# EAGLE design super-nintendo-forever (EAGLE 7.7.0)
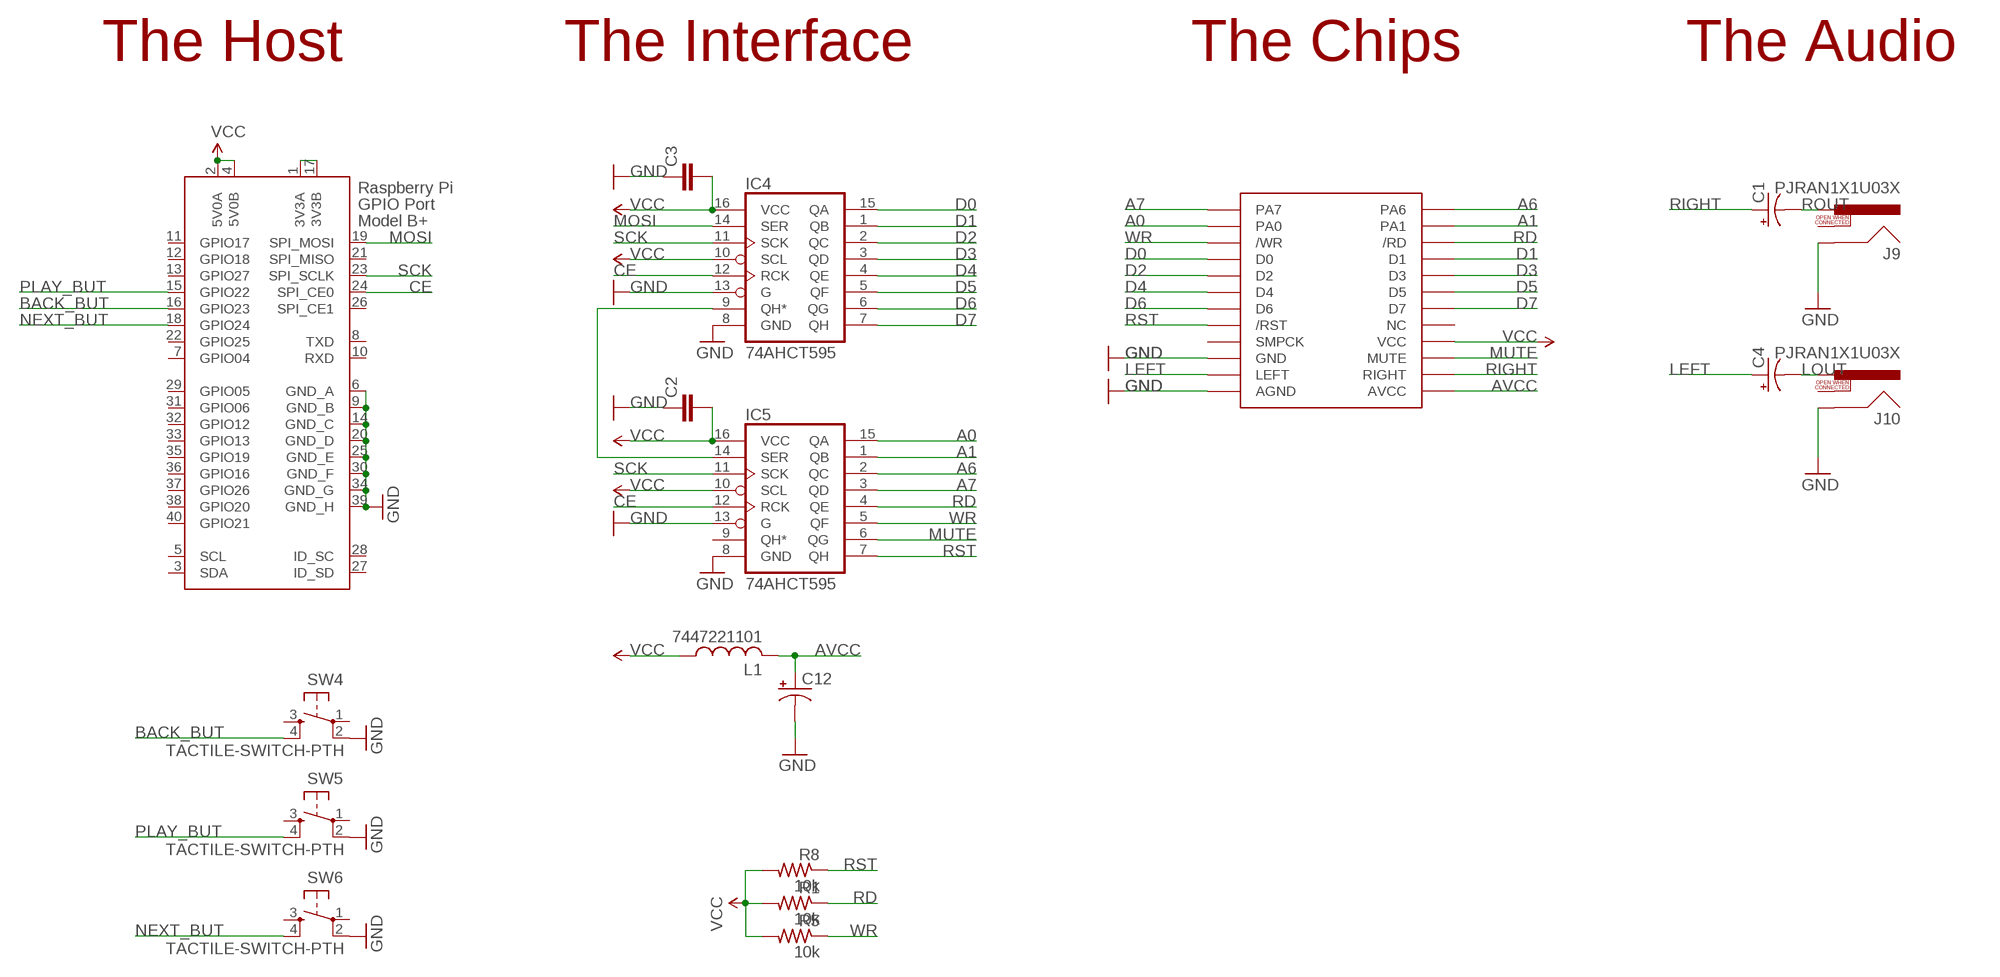
[diagram p0: schematic, sheet 1]

## Parts
C1  CPOL-USE2-4  [E2-4]
C2  C-EU025-024X044  [C025-024X044]
C3  C-EU025-024X044  [C025-024X044]
C4  CPOL-USE2-4  [E2-4]
C12  CPOL-USE2-4  [E2-4]
IC4  74AHCT595  74LS595N  [DIL16]
IC5  74AHCT595  74LS595N  [DIL16]
J9  PJRAN1X1U03X  RCA  [RCA]
J10  PJRAN1X1U03X  RCA  [RCA]
L1  7447221101  L  [12MMINDUCTOR]
R1  10k  R-US_0207/7  [0207/7]
R5  10k  R-US_0207/7  [0207/7]
R8  10k  R-US_0207/7  [0207/7]
SW4  TACTILE-SWITCH-PTH  [TAC-SWITCH-PTH]
SW5  TACTILE-SWITCH-PTH  [TAC-SWITCH-PTH]
SW6  TACTILE-SWITCH-PTH  [TAC-SWITCH-PTH]
U$1  APU2  [APU3]
X2  RASPI_BOARD_B+#_E4  [RASPI_BOARD_B+_EDGES_4DRILL]

## Nets
3.3V [Power]: X2.1(3V3A) X2.17(3V3B)
A0: IC5.15(QA) U$1.A0
A1: IC5.1(QB) U$1.PA1
A6: IC5.2(QC) U$1.PA6
A7: IC5.3(QD) U$1.A7
AVCC [Power]: C12.+ L1.3 U$1.VCCA(AVCC)
BACK_BUT: SW4.4 X2.16(GPIO23)
CE: IC4.12(RCK) IC5.12(RCK) X2.24(SPI_CE0)
D0: IC4.15(QA) U$1.D0
D1: IC4.1(QB) U$1.D1
D2: IC4.2(QC) U$1.D2
D3: IC4.3(QD) U$1.D3
D4: IC4.4(QE) U$1.D4
D5: IC4.5(QF) U$1.D5
D6: IC4.6(QG) U$1.D6
D7: IC4.7(QH) U$1.D7
GND [Power]: C2.1 C3.1 C12.- IC4.8(GND) IC4.13(G) IC5.8(GND) IC5.13(G) J9.SHELL J10.SHELL SW4.2 SW5.2 SW6.2 U$1.GND U$1.GNDA(AGND) U$1.P$25(GND) U$1.P$26(GND) X2.6(GND_A) X2.9(GND_B) X2.14(GND_C) X2.20(GND_D) X2.25(GND_E) X2.30(GND_F) X2.34(GND_G) X2.39(GND_H)
LEFT: C4.+ U$1.OUTL(LEFT)
LOUT: C4.- J10.PIN
MOSI: IC4.14(SER) X2.19(SPI_MOSI)
MUTE: IC5.6(QG) U$1.MUTE
N$16: IC4.9(QH*) IC5.14(SER)
NEXT_BUT: SW6.4 X2.18(GPIO24)
PLAY_BUT: SW5.4 X2.15(GPIO22)
RD: IC5.4(QE) R1.1 U$1.!RD(/RD)
RIGHT: C1.+ U$1.OUTR(RIGHT)
ROUT: C1.- J9.PIN
RST: IC5.7(QH) R8.1 U$1.!RST(/RST)
SCK: IC4.11(SCK) IC5.11(SCK) X2.23(SPI_SCLK)
VCC [Power]: C2.2 C3.2 IC4.10(SCL) IC4.16(VCC) IC5.10(SCL) IC5.16(VCC) L1.2 R1.2 R5.2 R8.2 U$1.VCC X2.2(5V0A) X2.4(5V0B)
WR: IC5.5(QF) R5.1 U$1.!WR(/WR)
Unconnected: IC5.9(QH*) J9.SWITCH J10.SWITCH SW4.1 SW4.3 SW5.1 SW5.3 SW6.1 SW6.3 U$1.NC U$1.SMPCLK(SMPCK) X2.3(SDA) X2.5(SCL) X2.7(GPIO04) X2.8(TXD) X2.10(RXD) X2.11(GPIO17) X2.12(GPIO18) X2.13(GPIO27) X2.21(SPI_MISO) X2.22(GPIO25) X2.26(SPI_CE1) X2.27(ID_SD) X2.28(ID_SC) X2.29(GPIO05) X2.31(GPIO06) X2.32(GPIO12) X2.33(GPIO13) X2.35(GPIO19) X2.36(GPIO16) X2.37(GPIO26) X2.38(GPIO20) X2.40(GPIO21)

## Notes on the sheet
- The Host | The Interface | The Chips | The Audio

## Library data of the parts
C1 C4 C12 = resistor:CPOL-US: POLARIZED CAPACITOR, American symbol
C2 C3 = rcl:C-EU: CAPACITOR, European symbol
IC4 IC5 = SparkFun-DigitalIC:74*595: 8-bit SHIFT REGISTER, output latch
J9 J10 = SparkFun-Connectors:RCA
L1 = adafruit:L
R1 R5 R8 = rcl:R-US_: RESISTOR, American symbol
SW4-SW6 = GeekAmmo:TACTILE-SWITCH: Tactile Switch 4 Pins, SPST NO
U$1 = caitsith2:APU
X2 = raspberrypi_bastelstube_v13:RASPI_BOARD_B+#: Raspberry Pi GPIO connector with markings for the outer dimensions of the Raspberry Pi board model B+ with different sets of drill holes or mounting pads All pins connected

## Net classes
1 Power: width 0.305 mm

## Board
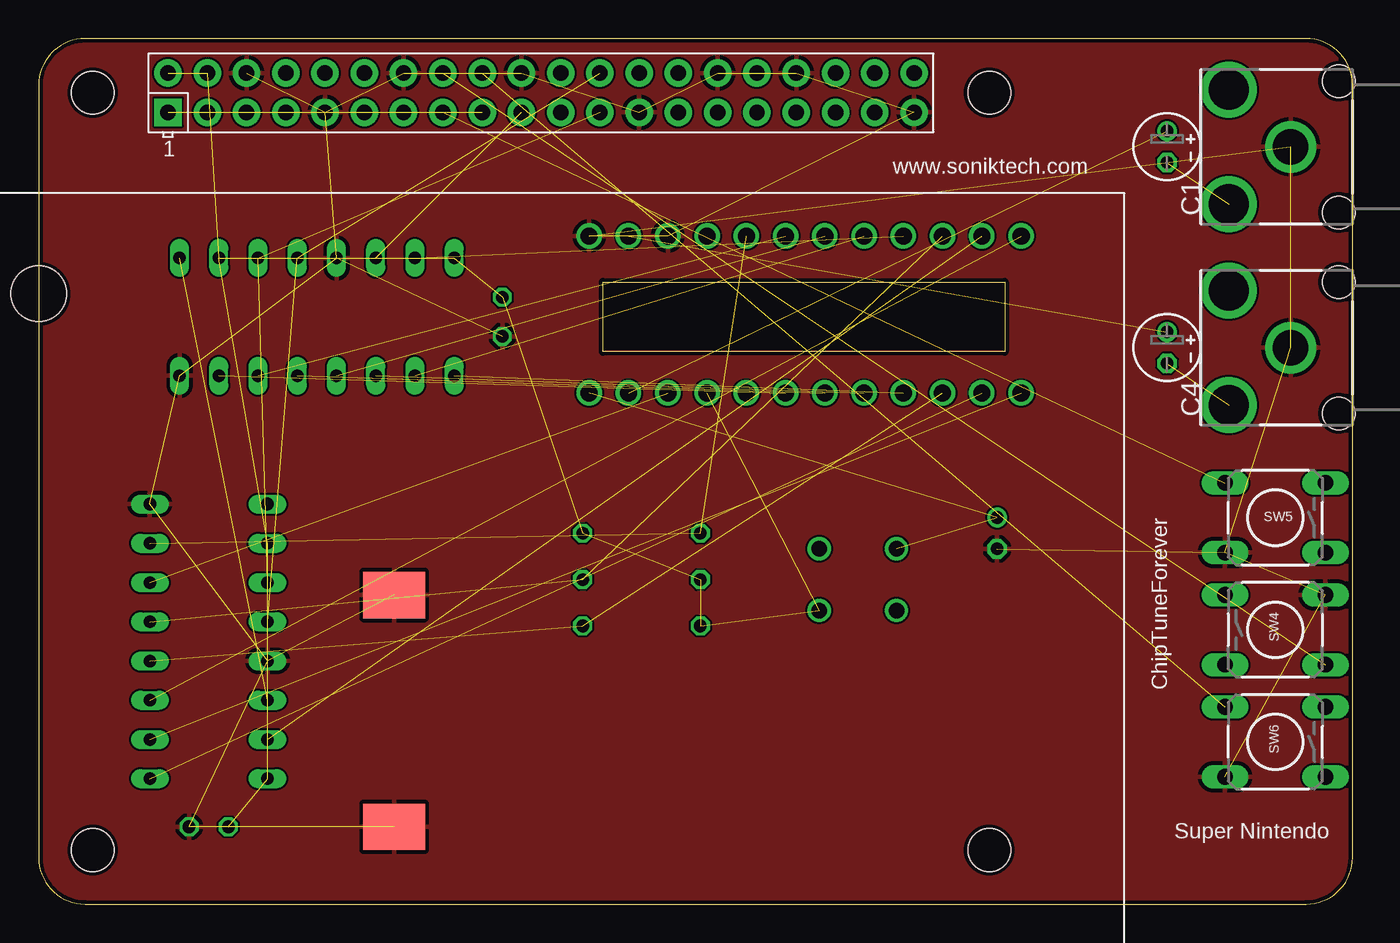
[diagram p1: board, top side]
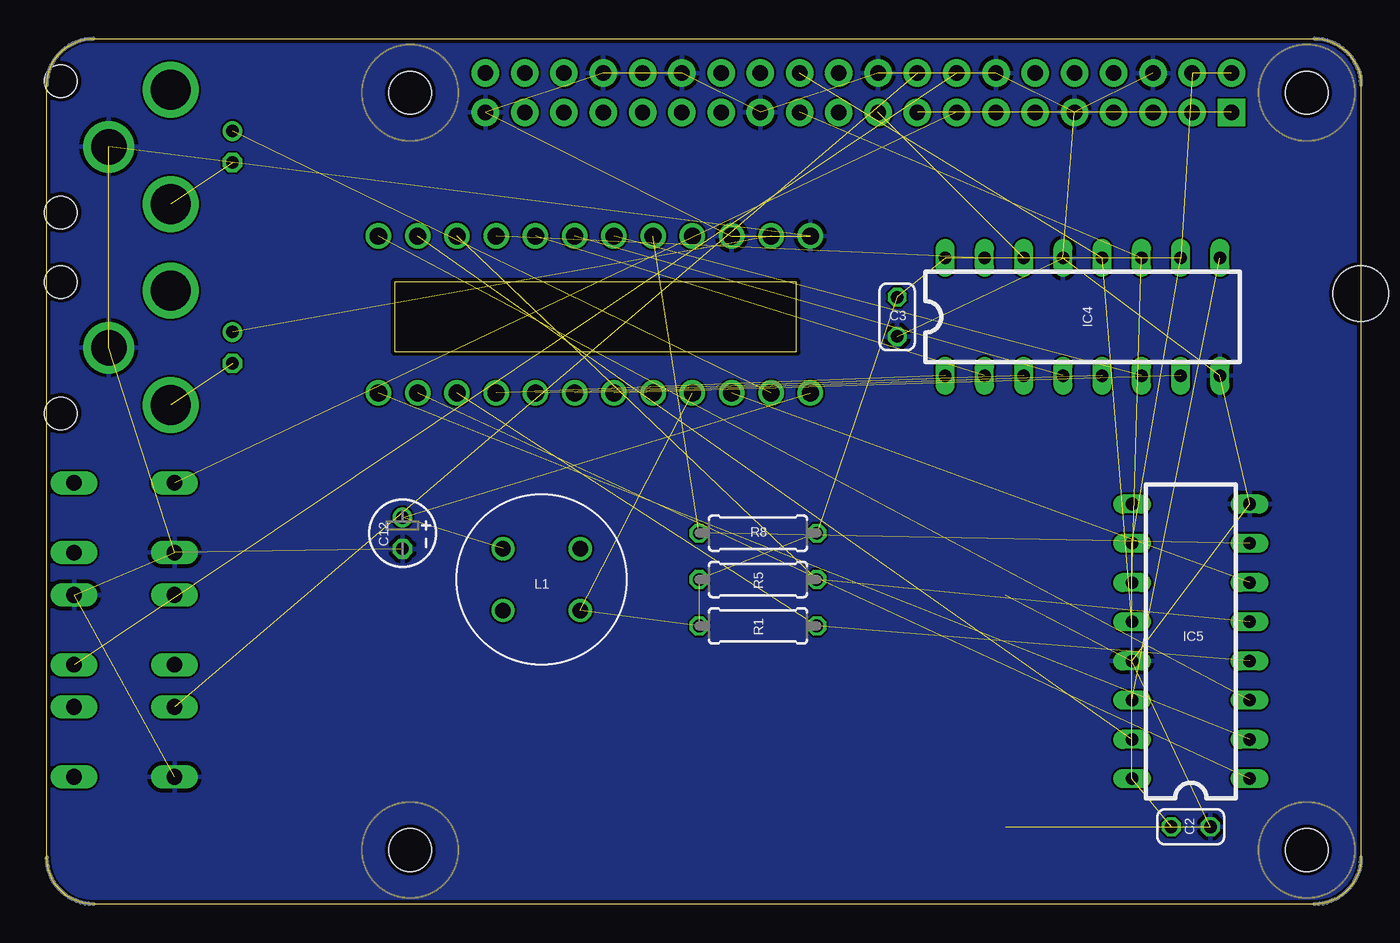
[diagram p2: board, bottom side, seen from below]

Size 85 x 56 mm. Coordinates in mm from the lower left corner, seen from the top.
Outline: 0,53 0,3 arc90 3,0 82,0 arc90 85,3 85,53 arc90 82,56 3,56 arc90 0,53
Copper layers (1*16): Top 0.035mm / dielectric 1.5mm / Bottom 0.035mm
Design rules "MF_Standard_2_Layer": minimum track width 5mil, minimum drill 12mil, track to track 5mil, track to pad 5mil, pad to pad 5mil, via to via 5mil, smd to smd 0mil, copper to edge 10mil, drill to drill 10mil, minimum pad ring 6mil, minimum via ring 6mil, stop-mask expansion 2mil, vias tented up to drill 25mil, thermal gap 10mil

### Footprints (pad centres in the part's own frame; a part is rotated, then mirrored left to right if it is on the bottom)
E2-4 = drill 0.813 pad 1.27: + -1.016,0 | drill 0.813 pad 1.27 octagon: - 1.016,0
C025-024X044 = drill 0.813 octagon: 1 -1.27,0; 2 1.27,0
DIL16 = drill 0.813 long: 1 -8.89,-3.81; 2 -6.35,-3.81; 3 -3.81,-3.81; 4 -1.27,-3.81; 5 1.27,-3.81; 6 3.81,-3.81; 7 6.35,-3.81; 8 8.89,-3.81; 9 8.89,3.81; 10 6.35,3.81; 11 3.81,3.81; 12 1.27,3.81; 13 -1.27,3.81; 14 -3.81,3.81; 15 -6.35,3.81; 16 -8.89,3.81
RCA = drill 2.6: PIN 4,3.7; SWITCH 4,-3.7 | drill 2.3: SHELL 0,0 | hole 2.1: -3.1,4.25; -3.1,-4.25
12MMINDUCTOR = drill 1: 1 -2.5,-2; 2 2.5,-2; 3 -2.5,2; 4 2.5,2
0207/7 = drill 0.813 octagon: 1 -3.81,0; 2 3.81,0
TAC-SWITCH-PTH = drill 1.016 pad 1.524 long: 1 -3.251,2.261; 2 3.251,2.261; 3 -3.251,-2.261; 4 3.251,-2.261
APU3 = drill 1.1: !RD 30.48,20.07; !RST 17.78,30.23; !WR 30.48,30.23; A0 33.02,30.23; A7 35.56,30.23; D0 27.94,30.23; D1 27.94,20.07; D2 25.4,30.23; D3 25.4,20.07; D4 22.86,30.23; D5 22.86,20.07; D6 20.32,30.23; D7 20.32,20.07; GND 12.7,30.23; GNDA 7.62,30.23; MUTE 12.7,20.07; NC 17.78,20.07; OUTL 10.16,30.23; OUTR 10.16,20.07; PA1 33.02,20.07; PA6 35.56,20.07; SMPCLK 15.24,30.23; VCC 15.24,20.07; VCCA 7.62,20.07 | smd 4 x 3: P$25 -5,7; P$26 -5,-8 | hole 3.6: 36,-30.5; -28,26.5; -28,-30.5
RASPI_BOARD_B+_EDGES_4DRILL = drill 1 pad 1.778 square: 1 8.37,51.23 | drill 1 pad 1.778: 2 8.37,53.77; 3 10.91,51.23; 4 10.91,53.77; 5 13.45,51.23; 6 13.45,53.77; 7 15.99,51.23; 8 15.99,53.77; 9 18.53,51.23; 10 18.53,53.77; 11 21.07,51.23; 12 21.07,53.77; 13 23.61,51.23; 14 23.61,53.77; 15 26.15,51.23; 16 26.15,53.77; 17 28.69,51.23; 18 28.69,53.77; 19 31.23,51.23; 20 31.23,53.77; 21 33.77,51.23; 22 33.77,53.77; 23 36.31,51.23; 24 36.31,53.77; 25 38.85,51.23; 26 38.85,53.77; 27 41.39,51.23; 28 41.39,53.77; 29 43.93,51.23; 30 43.93,53.77; 31 46.47,51.23; 32 46.47,53.77; 33 49.01,51.23; 34 49.01,53.77; 35 51.55,51.23; 36 51.55,53.77; 37 54.09,51.23; 38 54.09,53.77; 39 56.63,51.23; 40 56.63,53.77 | hole 2.75: 3.5,3.5; 3.5,52.5; 61.5,3.5; 61.5,52.5

### Placement (x,y rotation side)
C1  73,49 270 top
C2  11,5 180 bottom
C3  30,38 90 bottom
C4  73,36 270 top
C12  62,24 270 bottom
IC4  18,38 0 bottom
IC5  11,17 90 bottom
J9  81,49 180 top
J10  81,36 180 top
L1  53,21 0 bottom
R1  39,18 180 bottom
R5  39,21 180 bottom
R8  39,24 0 bottom
SW4  80,17.75 0 top
SW5  80,25 180 top
SW6  80,10.5 180 top
U$1  28,13 0 top
X2  0,0 0 top

### Tracks (layer width: path | path; a pad name or v marks a point on that pad's centre or on a via)
3.3V  (1 unrouted)
A0  (1 unrouted)
A1  (1 unrouted)
A6  (1 unrouted)
A7  (1 unrouted)
AVCC  (2 unrouted)
BACK_BUT  (1 unrouted)
CE  (2 unrouted)
D0  (1 unrouted)
D1  (1 unrouted)
D2  (1 unrouted)
D3  (1 unrouted)
D4  (1 unrouted)
D5  (1 unrouted)
D6  (1 unrouted)
D7  (1 unrouted)
GND  (23 unrouted)
  pour Bottom: 0,56 85,56 85,0 0,0
  pour Top: 0,56 85,56 85,0 0,0
LEFT  (1 unrouted)
LOUT  (1 unrouted)
MOSI  (1 unrouted)
MUTE  (1 unrouted)
N$16  (1 unrouted)
NEXT_BUT  (1 unrouted)
PLAY_BUT  (1 unrouted)
RD  (2 unrouted)
RIGHT  (1 unrouted)
ROUT  (1 unrouted)
RST  (2 unrouted)
SCK  (2 unrouted)
VCC  (12 unrouted)
WR  (2 unrouted)

### Text on the board
tNames: www.soniktech.com | ChipTuneForever | Super Nintendo